# Altium schematic sheet Block Diagram.SchDoc
size A4; SheetNumber: 4; SheetTotal: 4
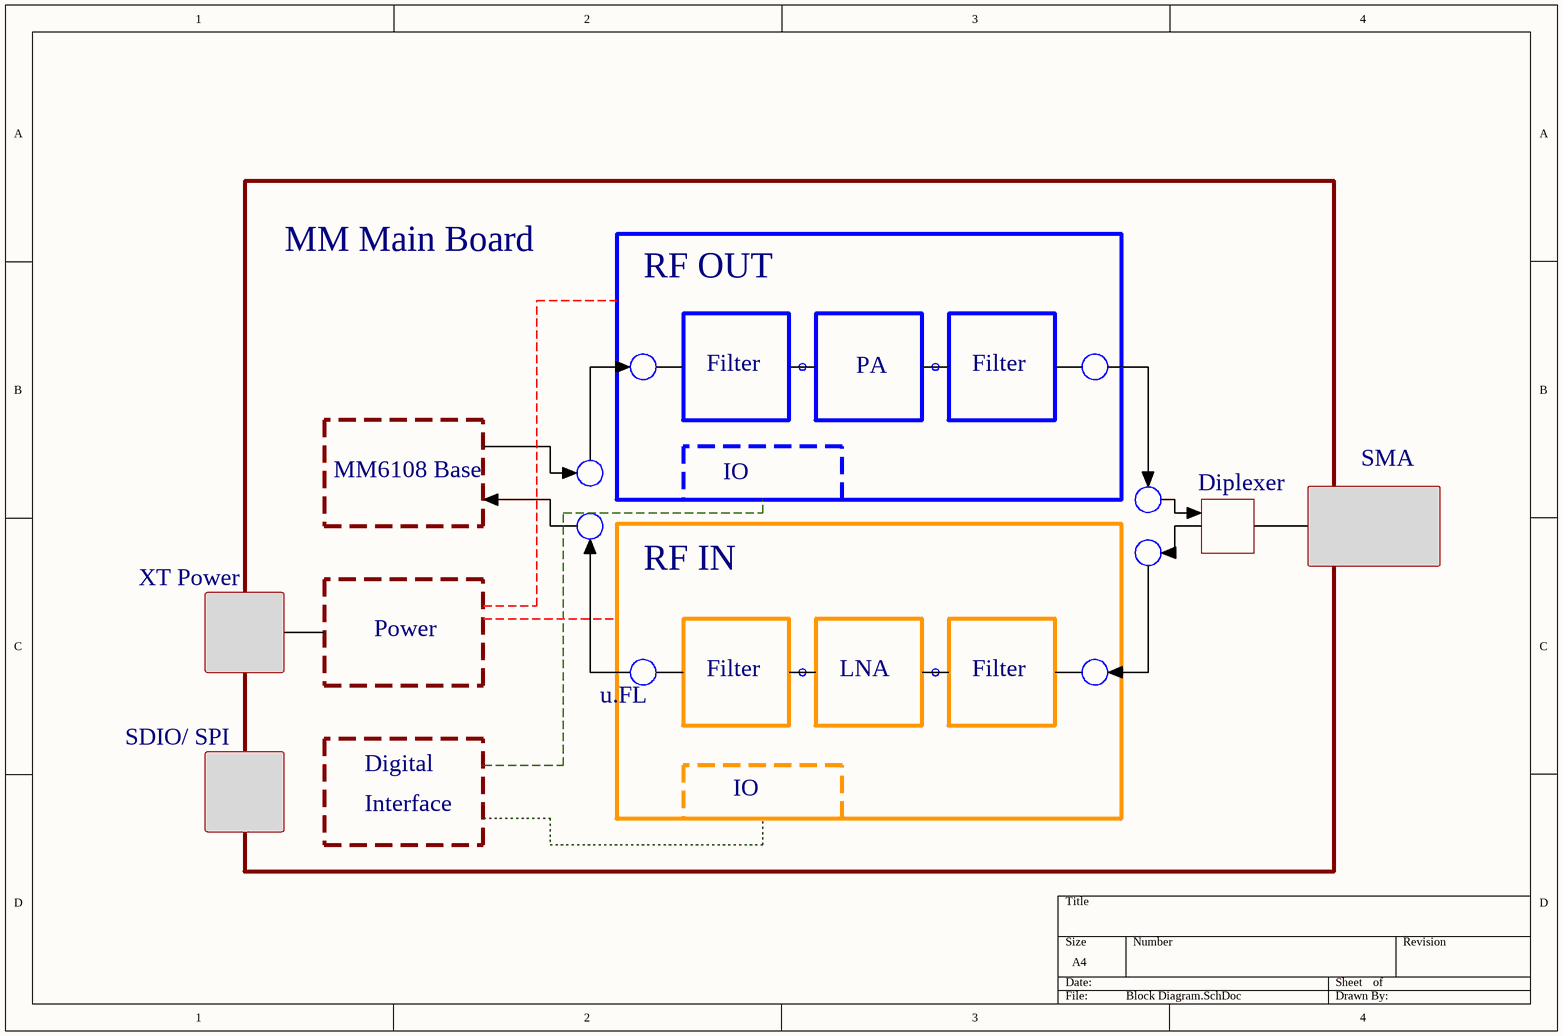
[diagram p0: Block Diagram.SchDoc]

## Notes on the sheet
- MM Main Board
- RF OUT
- Filter
- PA
- MM6108 Base
- IO
- Diplexer
- SMA
- RF IN
- XT Power
- Power
- u.FL
- LNA
- SDIO/ SPI
- Digital
- Interface